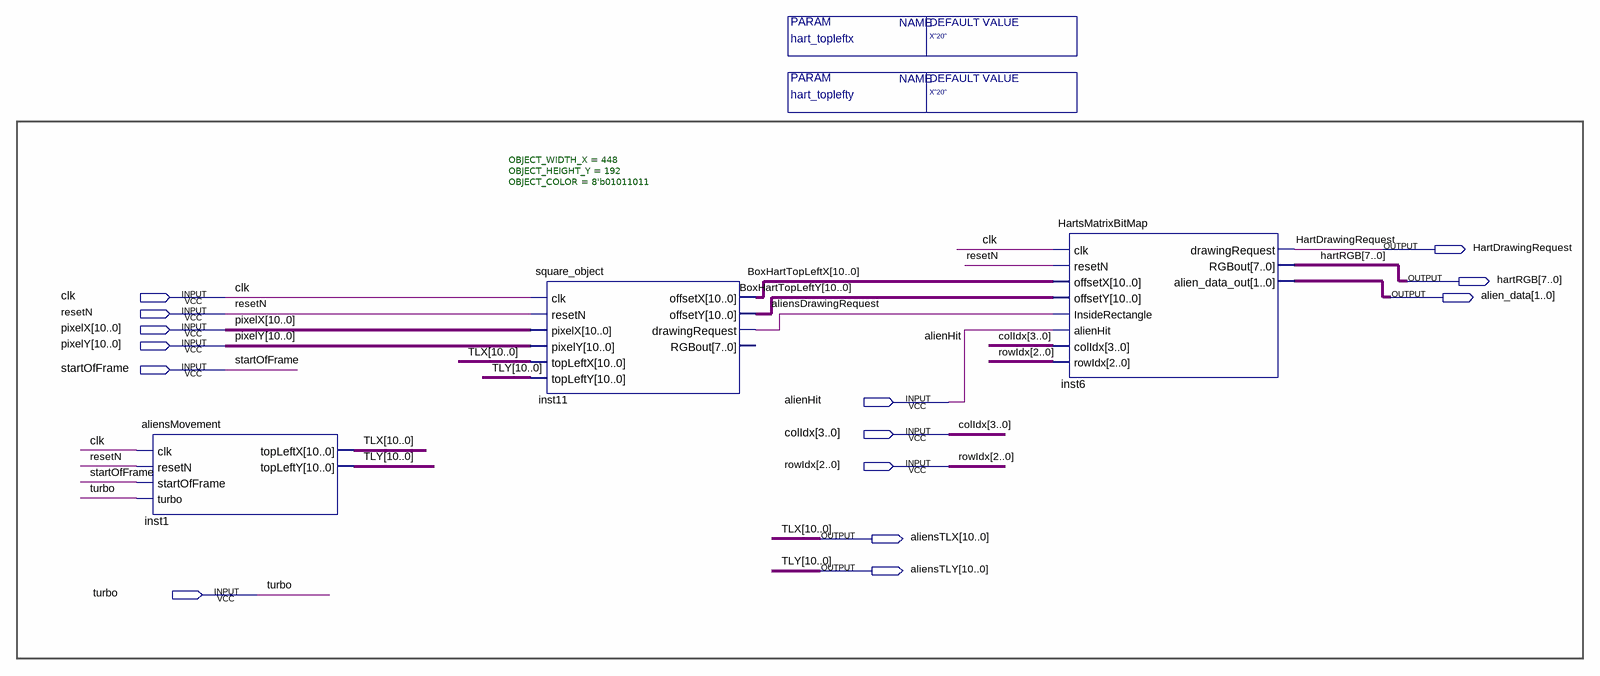
[diagram p0: schematic sheet]
// Quartus schematic HART_DISPLAY.bdf as structural Verilog: 3 symbols, 14 pins
module HART_DISPLAY #(parameter hart_topleftx = "X\"20\"", parameter hart_toplefty = "X\"20\"") (
  input  clk,
  input  resetN,
  input  [10:0] pixelX,
  input  [10:0] pixelY,
  input  startOfFrame,
  input  alienHit,
  input  [3:0] colIdx,
  input  [2:0] rowIdx,
  input  turbo,
  output HartDrawingRequest,
  output [7:0] hartRGB,
  output [1:0] alien_data,
  output [10:0] aliensTLX,
  output [10:0] aliensTLY
);

  wire aliensDrawingRequest;
  wire [10:0] BoxHartTopLeftX, BoxHartTopLeftY;

  aliensMovement inst1 (
    .clk(clk), .resetN(resetN), .startOfFrame(startOfFrame), .turbo(turbo), .topLeftX(aliensTLX),
    .topLeftY(aliensTLY));
  square_object #(.OBJECT_WIDTH_X(448), .OBJECT_HEIGHT_Y(192), .OBJECT_COLOR(8'b01011011)) inst11 (
    .clk(clk), .resetN(resetN), .pixelX(pixelX), .pixelY(pixelY), .topLeftX(aliensTLX), .topLeftY(aliensTLY),
    .offsetX(BoxHartTopLeftX), .offsetY(BoxHartTopLeftY), .drawingRequest(aliensDrawingRequest));  // open: RGBout
  HartsMatrixBitMap inst6 (
    .clk(clk), .resetN(resetN), .offsetX(BoxHartTopLeftX), .offsetY(BoxHartTopLeftY),
    .InsideRectangle(aliensDrawingRequest), .alienHit(alienHit), .colIdx(colIdx), .rowIdx(rowIdx),
    .drawingRequest(HartDrawingRequest), .RGBout(hartRGB), .alien_data_out(alien_data));

  // Other names for the same wires on the sheet: TLX[10:0] = aliensTLX; TLY[10:0] = aliensTLY
endmodule
